# EAGLE design power_supply (EAGLE 7.1.0)
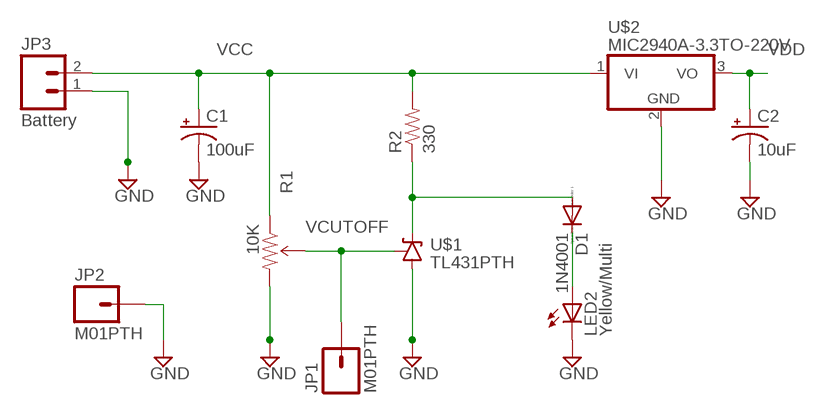
[diagram p0: schematic, sheet 1]

## Parts
C1  100uF  CPOL-USE3.5-8  [E3,5-8]
C2  10uF  CPOL-USE2.5-5  [E2,5-5]
D1  1N4001  1N4004  [DO41-10]
JP1  M01PTH  [1X01]
JP2  M01PTH  [1X01]
JP3  Battery  M02PTH  [1X02]
LED2  Yellow/Multi  LED5MM  [LED5MM]
R1  10K  TRIMPOT-PTH-KNOB  [3386U]
R2  330  RESISTORAXIAL-0.3  [AXIAL-0.3]
U$1  TL431PTH  [TO-92]
U$2  MIC2940A-3.3TO-220V  [TO-220V]

## Nets
GND: C1.- C2.- JP2.1 JP3.1 LED2.K(C) R1.3(CW) U$1.2(A) U$2.2(GND)
N$1: D1.C LED2.A
N$2: D1.A R2.P$1 U$1.3(C)
VCC: C1.+ JP3.2 R1.1(CCW) R2.P$2 U$2.1(VI)
VCUTOFF: JP1.1 R1.2(WIPER) U$1.1(R)
VDD: C2.+ U$2.3(VO)

## Library data of the parts
C1 C2 = rcl:CPOL-US: POLARIZED CAPACITOR, American symbol
D1 = diode:1N4004: DIODE general purpose rectifier, 1 A
JP1 JP2 = SparkFun:M01: Header 1 Standard 1-pin 0.1" header. Use with straight break away headers (SKU : PRT-00116), right angle break away headers (PRT-00553), swiss pins (PRT-00743), machine pins (PRT-00117), and female headers (PRT-00115).
JP3 = SparkFun:M02: Header 2 Standard 2-pin 0.1" header. Use with straight break away headers (SKU : PRT-00116), right angle break away headers (PRT-00553), swiss pins (PRT-00743), machine pins (PRT-00117), and female headers (PRT-00115). Molex polarized connector foot print use with SKU : PRT-08233 with associated crimp pins and housings.
LED2 = SparkFun:LED: LEDs Standard schematic elements and footprints for 5mm, 3mm, 1206, and 0603 sized LEDs. 5mm - Spark Fun Electronics SKU : COM-00529 (and others)
R1 = Power:TRIMPOT; CREATOR: Brandon; REVIEWER1: Chris
R2 = SparkFun:RESISTOR: Resistor Basic schematic elements and footprints for 0603, 1206, and PTH resistors.
U$1 = SparkFun:TL431
U$2 = SparkFun:MIC2940A-3.3: MIC2940A-3.3 Voltage Regulator 3.3V mic2940.pdf

## Board
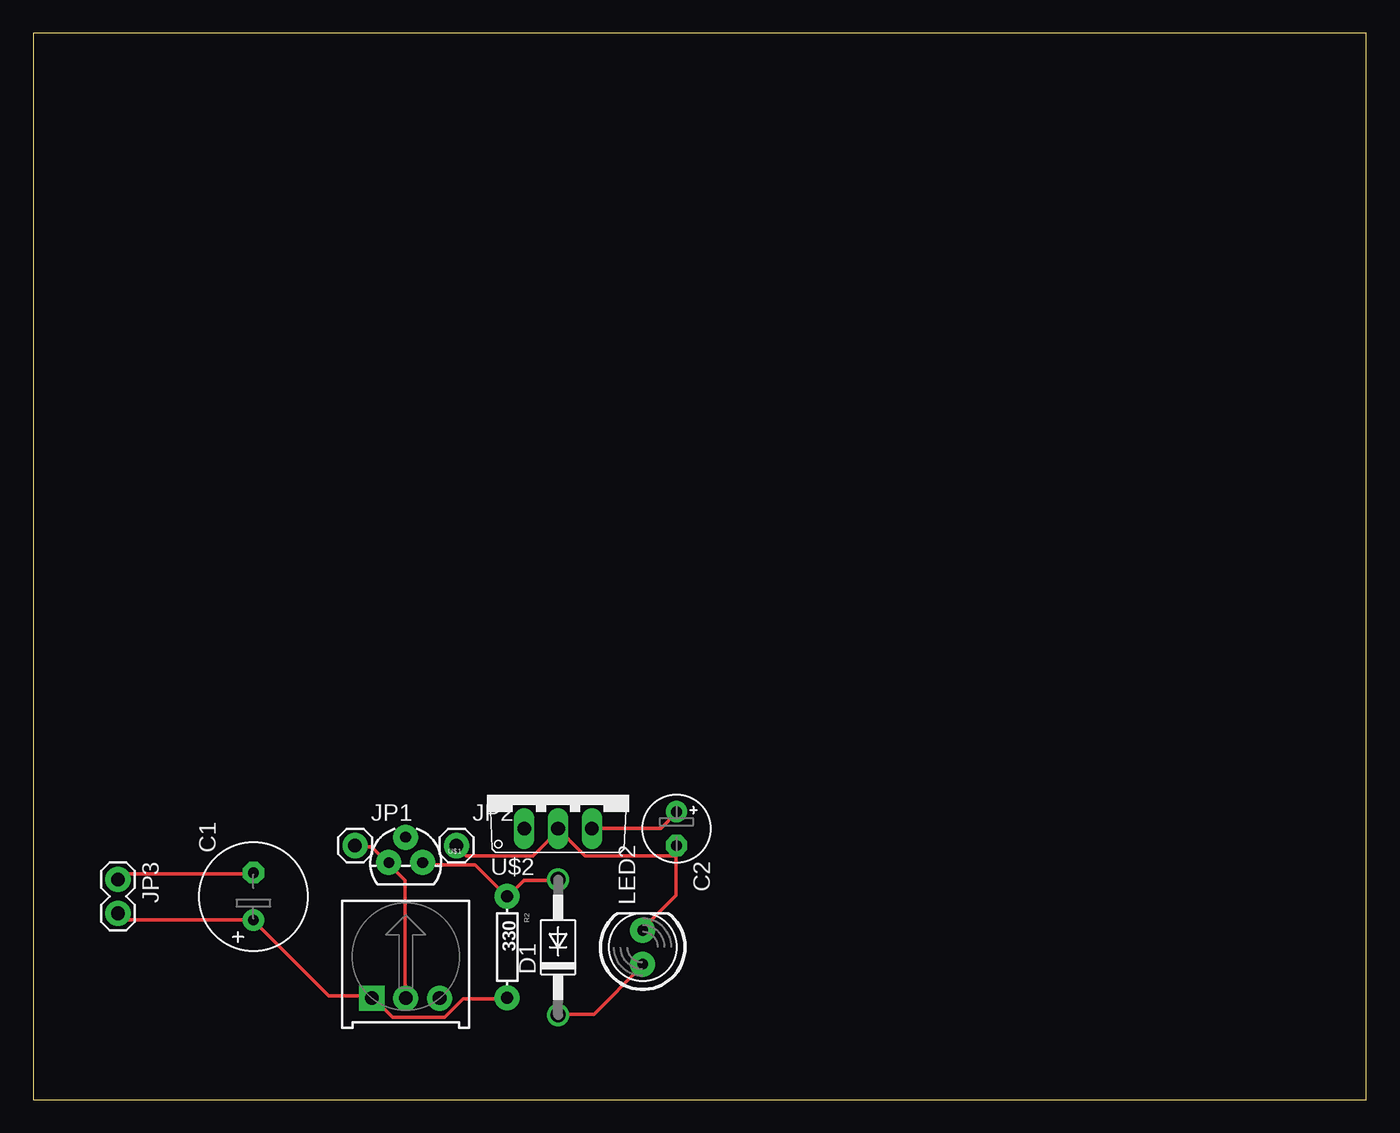
[diagram p1: board, top side]
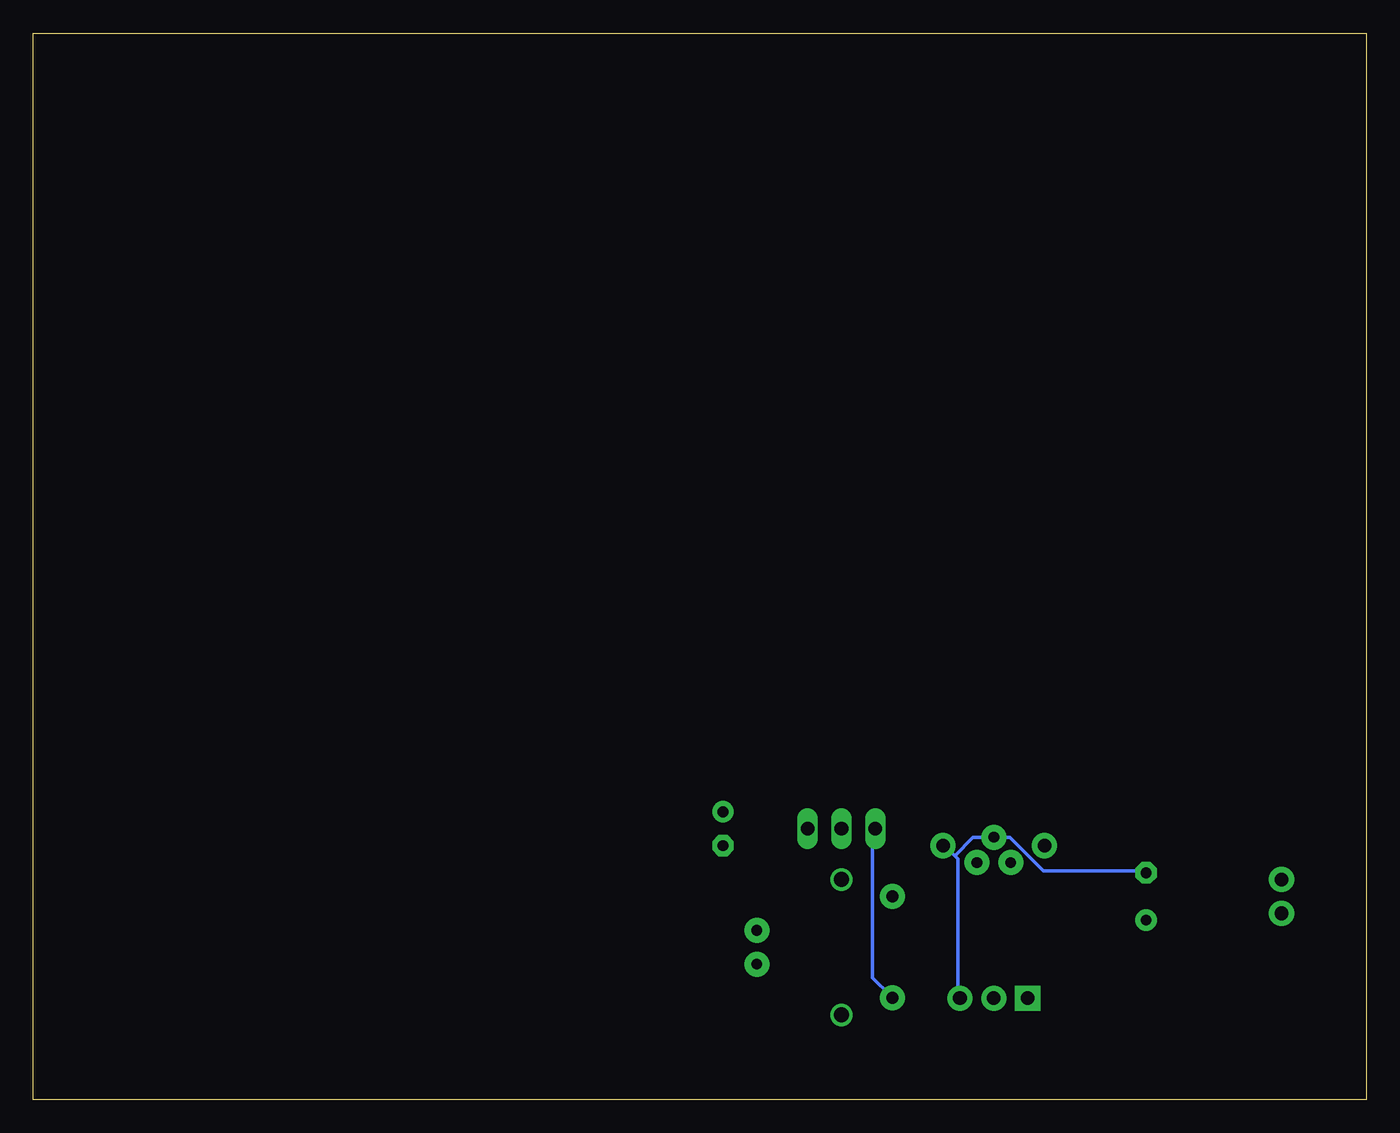
[diagram p2: board, bottom side, seen from below]

Size 100 x 80 mm. Coordinates in mm from the lower left corner, seen from the top.
Outline: 0,0 100,0 100,80 0,80 0,0
Copper layers (1*16): Top 0.035mm / dielectric 1.5mm / Bottom 0.035mm
Design rules "default": minimum track width 10mil, minimum drill 24mil, track to track 8mil, track to pad 8mil, pad to pad 8mil, via to via 8mil, smd to smd 8mil, copper to edge 40mil, drill to drill 8mil, minimum pad ring 10mil, minimum via ring 8mil, stop-mask expansion 4mil, vias tented up to drill 0mil, thermal gap 10mil

### Footprints (pad centres in the part's own frame; a part is rotated, then mirrored left to right if it is on the bottom)
E3,5-8 = drill 0.813 pad 1.6: + -1.778,0 | drill 0.813 pad 1.6 octagon: - 1.778,0
E2,5-5 = drill 0.813 pad 1.6: + -1.27,0 | drill 0.813 pad 1.6 octagon: - 1.27,0
DO41-10 = drill 1.118: A 5.08,0; C -5.08,0
1X01 = drill 1.016 pad 1.88: 1 0,0
1X02 = drill 1.016 pad 1.88: 1 0,0; 2 2.54,0
LED5MM = drill 0.813 pad 1.88: A -1.27,0; K 1.27,0
3386U = drill 1.016 pad 1.88 square: 1 -2.54,-2.555 | drill 1.016 pad 1.88: 2 0,-2.555; 3 2.54,-2.555
AXIAL-0.3 = drill 0.9 pad 1.88: P$1 -3.81,0; P$2 3.81,0
TO-92 = drill 0.813 pad 1.88: 1 -1.27,0; 2 0,1.905; 3 1.27,0
TO-220V = drill 1.016 long: 1 -1.27,0; 2 1.27,0; 3 3.81,0

### Placement (x,y rotation side)
C1  16.51,15.24 90 top
C2  48.26,20.32 270 top
D1  39.37,11.43 90 top
JP1  24.13,19.05 0 top
JP2  31.75,19.05 0 top
JP3  6.35,16.51 270 top
LED2  45.72,11.43 90 top
R1  27.94,10.16 0 top
R2  35.56,11.43 270 top
U$1  27.94,17.78 0 top
U$2  38.1,20.32 0 top

### Tracks (layer width: path | path; a pad name or v marks a point on that pad's centre or on a via)
GND
  Top 0.254: C1.- 16.46,16.92 6.63,16.92 6.4,16.69 JP3.1 | 48.23,18.29 48.23,15.32 45.72,12.8 LED2.K | 48.23,18.29 48.23,18.97 C2.- 48.23,18.29 | JP2.1 31.77,18.97 32.46,18.29 37.49,18.29 39.32,20.12 U$2.2 39.55,20.12 41.38,18.29 48.23,18.29
  Bottom 0.254: 30.86,18.29 31.55,18.97 JP2.1 | 30.86,18.29 30.63,18.06 30.63,7.77 R1.3 | 30.86,18.29 29.49,19.66 28.12,19.66 U$1.2 27.89,19.66 26.75,19.66 24.23,17.14 16.69,17.14 C1.-
N$1
  Top 0.254: D1.C 39.55,6.4 42.06,6.4 45.72,10.06 LED2.A
N$2
  Top 0.254: D1.A 39.32,16.46 36.8,16.46 35.66,15.32 R2.P$1 35.43,15.32 33.15,17.6 29.26,17.6 U$1.3
VCC
  Top 0.254: JP3.2 6.4,13.95 6.86,13.49 16.46,13.49 C1.+ 16.69,13.26 22.17,7.77 25.38,7.77 R1.1 25.6,7.54 26.98,6.17 30.86,6.17 32.23,7.54 35.43,7.54 R2.P$2
  Bottom 0.254: U$2.1 37.03,20.12 37.03,9.14 35.66,7.77 R2.P$2
VCUTOFF
  Top 0.254: JP1.1 24.23,18.97 25.38,18.97 26.52,17.83 U$1.1 26.75,17.6 27.89,16.46 27.89,7.77 R1.2
VDD
  Top 0.254: U$2.3 42.06,20.34 47.09,20.34 48.23,21.49 C2.+